# Altium schematic sheet POWER.SchDoc
size A4
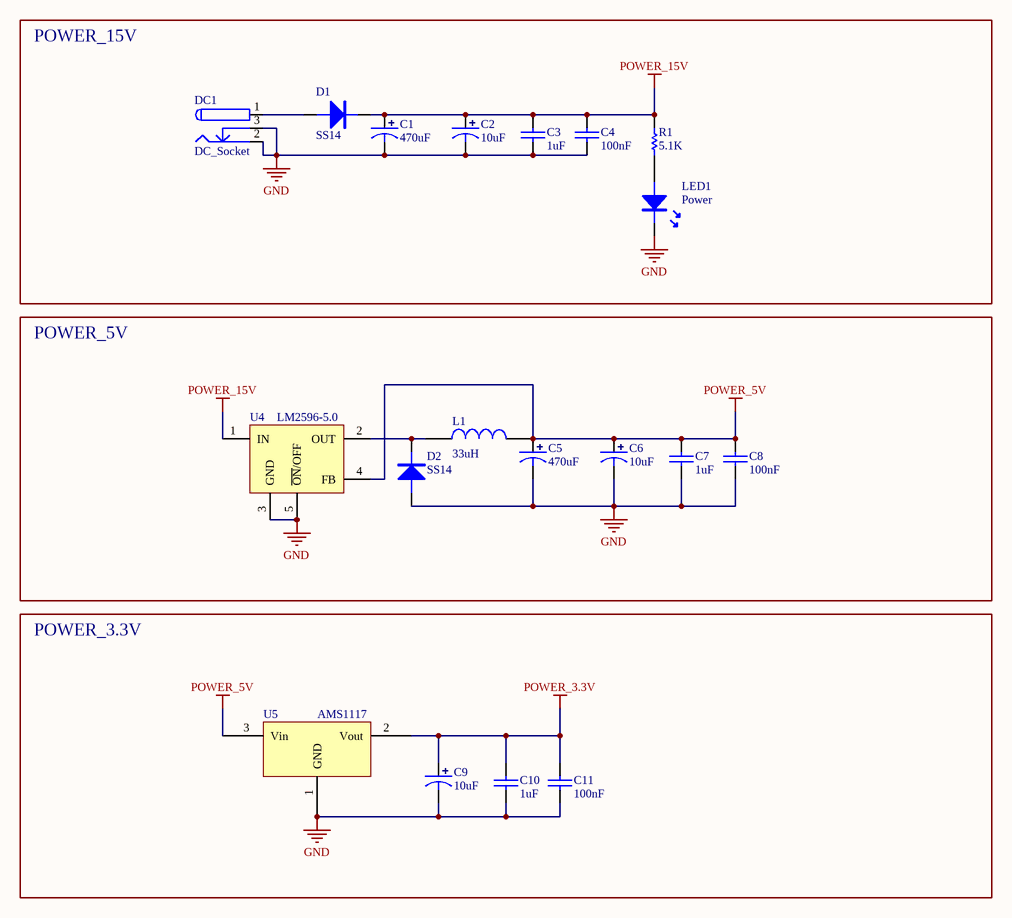
[diagram p0: POWER.SchDoc]

## Parts
C1  470uF  [SMD-EC5.0X5.3X5.4]
C2  10uF  [TAJ-B/3528]
C3  1uF  [0603C]
C4  100nF  [0603C]
C5  470uF  [SMD-EC5.0X5.3X5.4]
C6  10uF  [TAJ-B/3528]
C7  1uF  [0603C]
C8  100nF  [0603C]
C9  10uF  [TAJ-B/3528]
C10  1uF  [0603C]
C11  100nF  [0603C]
D1  SS14  [SMB/DO-214AA]
D2  SS14  [SMB/DO-214AA]
DC1  DC_Socket  [DC-005]
L1  33uH  [CDRH74]
LED1  Power  [LED-0805R]
R1  5.1K  [0603R]
U4  LM2596-5.0  [TO263-5A]
U5  AMS1117  [SOT223]

## Blocks framed on the sheet
POWER_15V: C1-C4 D1 DC1 LED1 R1
POWER_5V: C5-C8 D2 L1 U4
POWER_3.3V: C9-C11 U5

## Nets
GND: C1.2 C2.2 C3.1 C4.1 C5.2 C6.2 C7.1 C8.1 C9.2 C10.1 C11.1 D2.A DC1.2 DC1.3 LED1.K U4.3(GND) U4.5(~{ON}/OFF) U5.1(GND)
POWER_3.3V: C9.1 C10.2 C11.2 U5.2(Vout)
POWER_5V: C5.1 C6.1 C7.2 C8.2 L1.2 U4.4(FB) U5.3(Vin)
POWER_15V: C1.1 C2.1 C3.2 C4.2 D1.K R1.2 U4.1(IN)
NetD1_A: D1.A DC1.1
NetD2_K: D2.K L1.1 U4.2(OUT)
NetLED1_A: LED1.A R1.1

## Library data of the parts
C1 C5 = SMD_CPOL: 贴片电解电容
C2 C6 C9 = TCAP_CPOL: 钽电容
C3 C4 C7 C8 C10 C11 = CAP: 无极性电容
D1 D2 = DIODE: 普通二极管
L1 = INDUCTOR
LED1 = LED
R1 = RES
U4 = LM2596-5.0: DC降压芯片
U5 = AMS1117: 三端稳压芯片